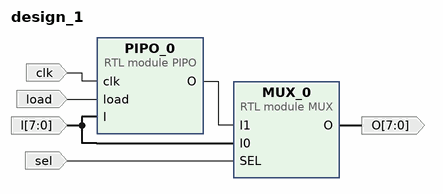
[diagram p0: block diagram of the top level]
# Vivado block design design_1, xc7z007sclg400-1, Vivado 2024.1.1
create_bd_design design_1

create_bd_port -dir I -from 7 -to 0 I
create_bd_port -dir I load
create_bd_port -dir I -type clk clk
set_property -dict {CONFIG.FREQ_HZ 100000000} [get_bd_ports clk]
create_bd_port -dir O -from 7 -to 0 O
create_bd_port -dir I sel

create_bd_cell -type module -reference PIPO PIPO_0
create_bd_cell -type module -reference MUX MUX_0

# ---- connections ----

connect_bd_net [get_bd_pins MUX_0/O] [get_bd_ports O]
connect_bd_net [get_bd_ports I] [get_bd_pins PIPO_0/I] [get_bd_pins MUX_0/I0]
connect_bd_net [get_bd_pins PIPO_0/O] [get_bd_pins MUX_0/I1]
connect_bd_net [get_bd_ports clk] [get_bd_pins PIPO_0/clk]
connect_bd_net [get_bd_ports load] [get_bd_pins PIPO_0/load]
connect_bd_net [get_bd_ports sel] [get_bd_pins MUX_0/SEL]

validate_bd_design
save_bd_design
